# EAGLE design AKA-BeagleBone-ProtoBoard-v0.1 (EAGLE 6.5.0)
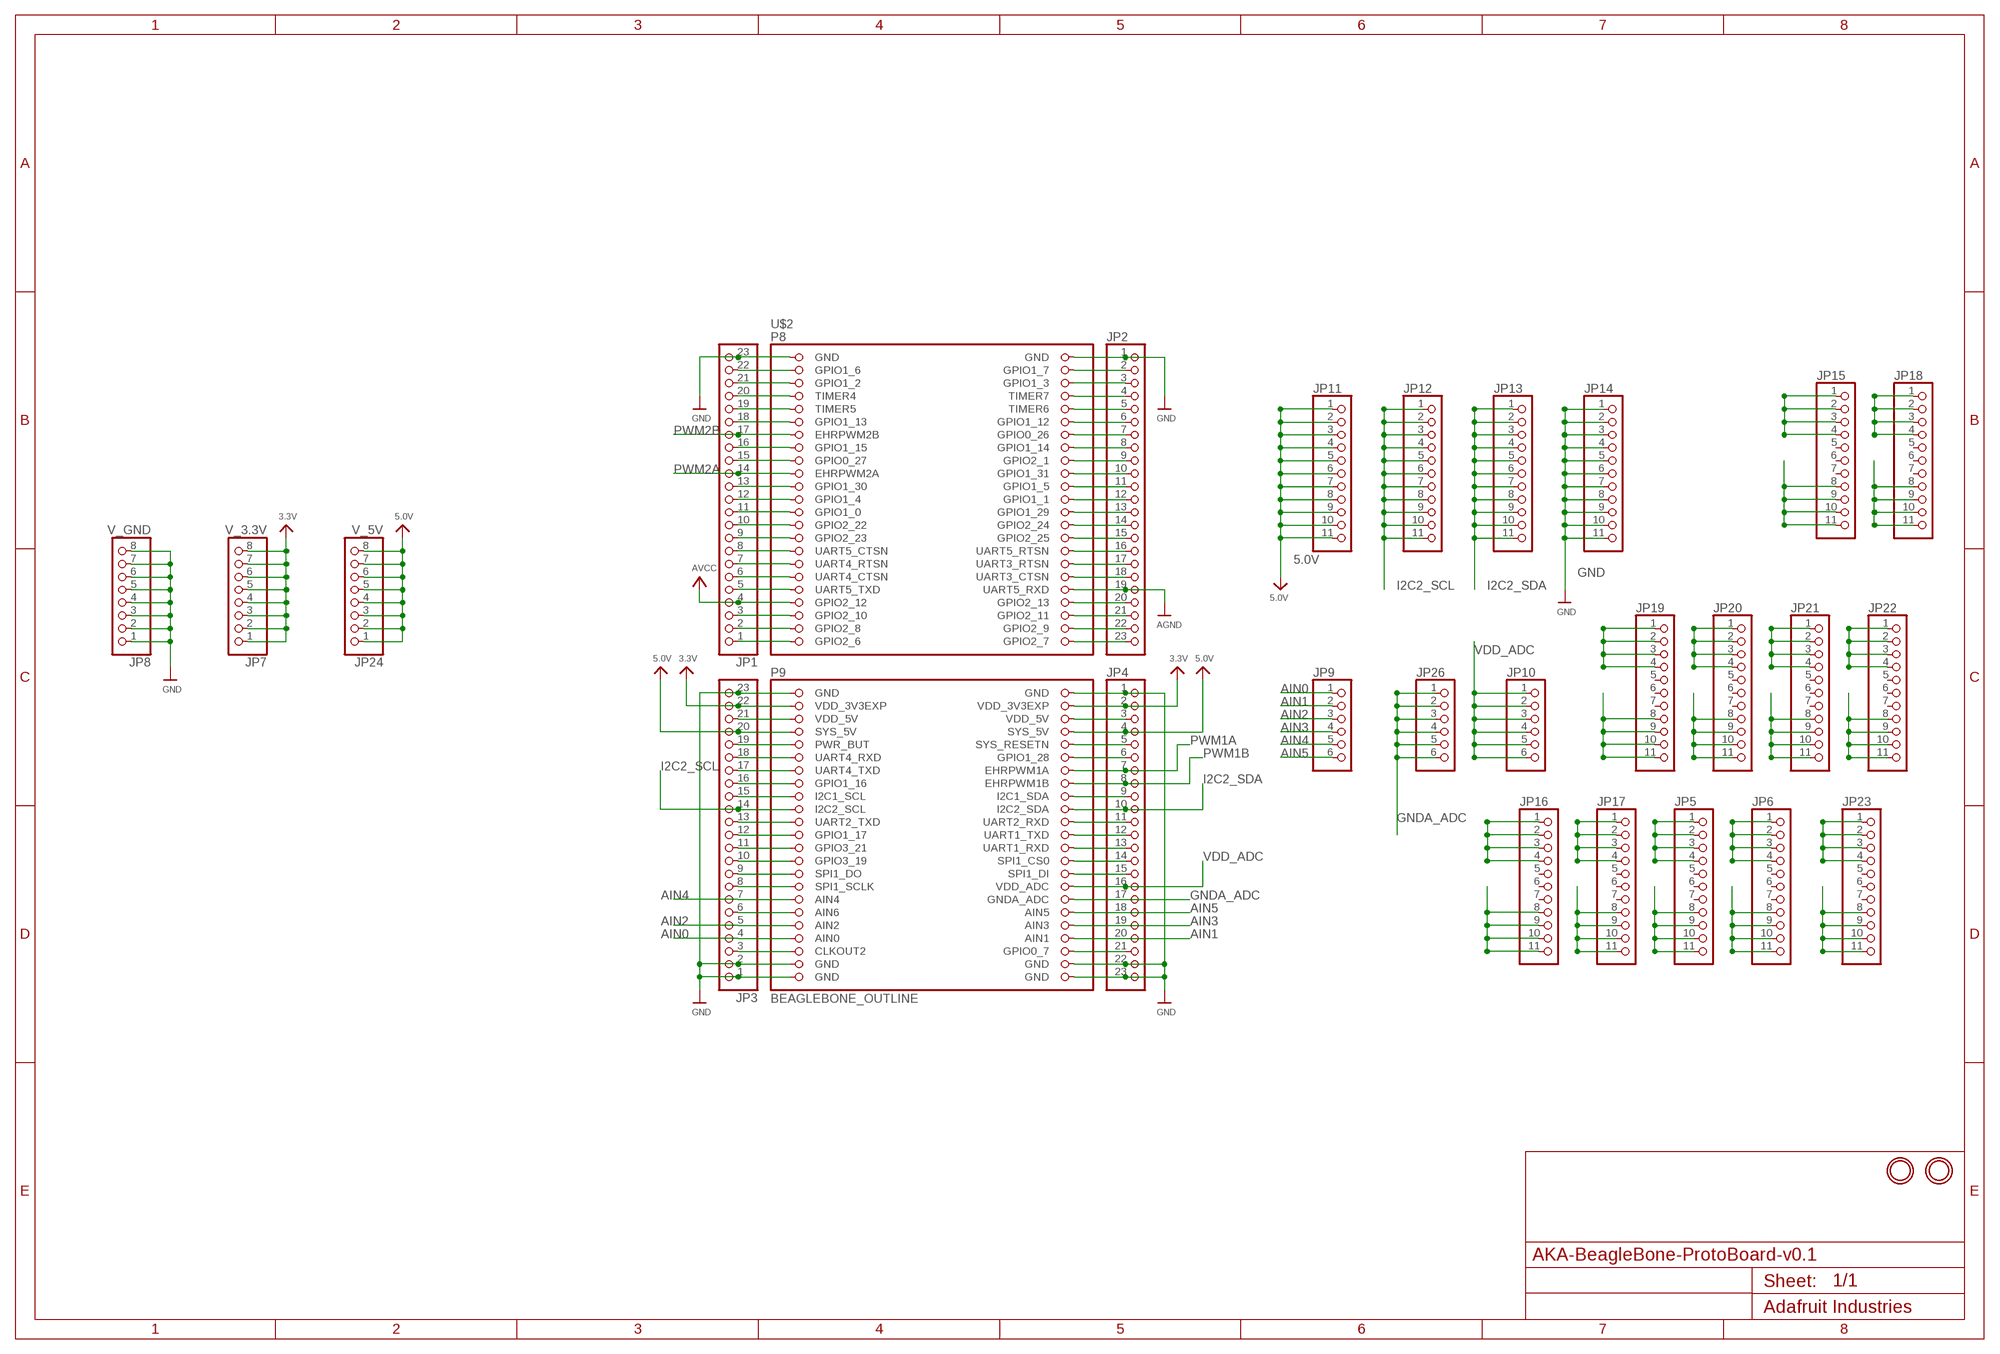
[diagram p0: schematic, sheet 1]

## Parts
JP1  HEADER-1X23  [1X23_ROUND_70MIL]
JP2  HEADER-1X23  [1X23_ROUND_70MIL]
JP3  HEADER-1X23  [1X23_ROUND_70MIL]
JP4  HEADER-1X23  [1X23_ROUND_70MIL]
JP5  HEADER-1X1176MIL  [1X11_ROUND_76]
JP6  HEADER-1X1176MIL  [1X11_ROUND_76]
JP7  V_3.3V  HEADER-1X870MIL  [1X08_ROUND_70]
JP8  V_GND  HEADER-1X870MIL  [1X08_ROUND_70]
JP9  HEADER-1X676MIL  [1X06_ROUND_76]
JP10  HEADER-1X676MIL  [1X06_ROUND_76]
JP11  HEADER-1X1176MIL  [1X11_ROUND_76]
JP12  HEADER-1X1176MIL  [1X11_ROUND_76]
JP13  HEADER-1X1176MIL  [1X11_ROUND_76]
JP14  HEADER-1X1176MIL  [1X11_ROUND_76]
JP15  HEADER-1X1176MIL  [1X11_ROUND_76]
JP16  HEADER-1X1176MIL  [1X11_ROUND_76]
JP17  HEADER-1X1176MIL  [1X11_ROUND_76]
JP18  HEADER-1X1176MIL  [1X11_ROUND_76]
JP19  HEADER-1X1176MIL  [1X11_ROUND_76]
JP20  HEADER-1X1176MIL  [1X11_ROUND_76]
JP21  HEADER-1X1176MIL  [1X11_ROUND_76]
JP22  HEADER-1X1176MIL  [1X11_ROUND_76]
JP23  HEADER-1X1176MIL  [1X11_ROUND_76]
JP24  V_5V  HEADER-1X870MIL  [1X08_ROUND_70]
JP26  HEADER-1X676MIL  [1X06_ROUND_76]
U$2  BEAGLEBONE_OUTLINE  [BEAGLEBONE_SHIELD]
U$22  MOUNTINGHOLE3.0THIN  [MOUNTINGHOLE_3.0_PLATEDTHIN]
U$23  MOUNTINGHOLE3.0THIN  [MOUNTINGHOLE_3.0_PLATEDTHIN]

## Nets
3.3V: JP3.22 JP4.2 JP7.1 JP7.2 JP7.3 JP7.4 JP7.5 JP7.6 JP7.7 JP7.8 U$2.49(VDD_3V3EXP) U$2.50(VDD_3V3EXP)
5.0V: JP3.20 JP4.4 JP11.1 JP11.2 JP11.3 JP11.4 JP11.5 JP11.6 JP11.7 JP11.8 JP11.9 JP11.10 JP11.11 JP24.1 JP24.2 JP24.3 JP24.4 JP24.5 JP24.6 JP24.7 JP24.8 U$2.53(SYS_5V) U$2.54(SYS_5V)
AGND: JP2.19 U$2.38(UART5_RXD)
AIN0: JP3.4 JP9.1 U$2.85(AIN0)
AIN1: JP4.20 JP9.2 U$2.86(AIN1)
AIN2: JP3.5 JP9.3 U$2.83(AIN2)
AIN3: JP4.19 JP9.4 U$2.84(AIN3)
AIN4: JP3.7 JP9.5 U$2.79(AIN4)
AIN5: JP4.18 JP9.6 U$2.82(AIN5)
AIN6: JP3.6 U$2.81(AIN6)
AVCC: JP1.4 U$2.39(GPIO2_12)
GND: JP1.23 JP2.1 JP3.1 JP3.2 JP3.23 JP4.1 JP4.22 JP4.23 JP8.1 JP8.2 JP8.3 JP8.4 JP8.5 JP8.6 JP8.7 JP8.8 JP14.1 JP14.2 JP14.3 JP14.4 JP14.5 JP14.6 JP14.7 JP14.8 JP14.9 JP14.10 JP14.11 U$2.1(GND) U$2.2(GND) U$2.47(GND) U$2.48(GND) U$2.89(GND) U$2.90(GND) U$2.91(GND) U$2.92(GND)
GNDA_ADC: JP4.17 JP26.1 JP26.2 JP26.3 JP26.4 JP26.5 JP26.6 U$2.80(GNDA_ADC)
I2C2_SCL: JP3.14 JP12.1 JP12.2 JP12.3 JP12.4 JP12.5 JP12.6 JP12.7 JP12.8 JP12.9 JP12.10 JP12.11 U$2.65(I2C2_SCL)
I2C2_SDA: JP4.10 JP13.1 JP13.2 JP13.3 JP13.4 JP13.5 JP13.6 JP13.7 JP13.8 JP13.9 JP13.10 JP13.11 U$2.66(I2C2_SDA)
N$1: JP15.1 JP15.2 JP15.3 JP15.4
N$2: JP16.1 JP16.2 JP16.3 JP16.4
N$3: JP17.1 JP17.2 JP17.3 JP17.4
N$4: JP1.20 U$2.7(TIMER4)
N$5: JP1.19 U$2.9(TIMER5)
N$6: JP1.18 U$2.11(GPIO1_13)
N$7: JP5.1 JP5.2 JP5.3 JP5.4
N$8: JP1.16 U$2.15(GPIO1_15)
N$9: JP1.15 U$2.17(GPIO0_27)
N$10: JP18.1 JP18.2 JP18.3 JP18.4
N$11: JP1.13 U$2.21(GPIO1_30)
N$12: JP1.12 U$2.23(GPIO1_4)
N$13: JP1.11 U$2.25(GPIO1_0)
N$14: JP1.10 U$2.27(GPIO2_22)
N$15: JP1.9 U$2.29(GPIO2_23)
N$16: JP1.8 U$2.31(UART5_CTSN)
N$17: JP1.7 U$2.33(UART4_RTSN)
N$18: JP1.6 U$2.35(UART4_CTSN)
N$19: JP1.5 U$2.37(UART5_TXD)
N$20: JP6.1 JP6.2 JP6.3 JP6.4
N$21: JP1.3 U$2.41(GPIO2_10)
N$22: JP1.2 U$2.43(GPIO2_8)
N$23: JP1.1 U$2.45(GPIO2_6)
N$24: JP19.1 JP19.2 JP19.3 JP19.4
N$25: JP20.1 JP20.2 JP20.3 JP20.4
N$26: JP21.1 JP21.2 JP21.3 JP21.4
N$27: JP2.4 U$2.8(TIMER7)
N$28: JP2.5 U$2.10(TIMER6)
N$29: JP2.6 U$2.12(GPIO1_12)
N$30: JP2.7 U$2.14(GPIO0_26)
N$31: JP2.8 U$2.16(GPIO1_14)
N$32: JP2.9 U$2.18(GPIO2_1)
N$33: JP2.10 U$2.20(GPIO1_31)
N$34: JP2.11 U$2.22(GPIO1_5)
N$35: JP2.12 U$2.24(GPIO1_1)
N$36: JP2.13 U$2.26(GPIO1_29)
N$37: JP2.14 U$2.28(GPIO2_24)
N$38: JP2.15 U$2.30(GPIO2_25)
N$39: JP2.16 U$2.32(UART5_RTSN)
N$40: JP2.17 U$2.34(UART3_RTSN)
N$41: JP2.18 U$2.36(UART3_CTSN)
N$42: JP22.1 JP22.2 JP22.3 JP22.4
N$43: JP2.20 U$2.40(GPIO2_13)
N$44: JP2.21 U$2.42(GPIO2_11)
N$45: JP2.22 U$2.44(GPIO2_9)
N$46: JP2.23 U$2.46(GPIO2_7)
N$47: JP1.22 U$2.3(GPIO1_6)
N$48: JP1.21 U$2.5(GPIO1_2)
N$49: JP3.21 U$2.51(VDD_5V)
N$50: JP2.2 U$2.4(GPIO1_7)
N$51: JP3.19 U$2.55(PWR_BUT)
N$52: JP3.18 U$2.57(UART4_RXD)
N$53: JP3.17 U$2.59(UART4_TXD)
N$54: JP3.16 U$2.61(GPIO1_16)
N$55: JP3.15 U$2.63(I2C1_SCL)
N$56: JP23.1 JP23.2 JP23.3 JP23.4
N$57: JP3.13 U$2.67(UART2_TXD)
N$58: JP3.12 U$2.69(GPIO1_17)
N$59: JP3.11 U$2.71(GPIO3_21)
N$60: JP3.10 U$2.73(GPIO3_19)
N$61: JP3.9 U$2.75(SPI1_DO)
N$62: JP3.8 U$2.77(SPI1_SCLK)
N$67: JP3.3 U$2.87(CLKOUT2)
N$68: JP2.3 U$2.6(GPIO1_3)
N$69: JP4.21 U$2.88(GPIO0_7)
N$72: JP4.3 U$2.52(VDD_5V)
N$74: JP4.5 U$2.56(SYS_RESETN)
N$75: JP4.6 U$2.58(GPIO1_28)
N$78: JP4.9 U$2.64(I2C1_SDA)
N$80: JP4.11 U$2.68(UART2_RXD)
N$81: JP4.12 U$2.70(UART1_TXD)
N$82: JP4.13 U$2.72(UART1_RXD)
N$83: JP4.14 U$2.74(SPI1_CS0)
N$84: JP4.15 U$2.76(SPI1_DI)
PWM1A: JP4.7 U$2.60(EHRPWM1A)
PWM1B: JP4.8 U$2.62(EHRPWM1B)
PWM2A: JP1.14 JP18.8 JP18.9 JP18.10 JP18.11 U$2.19(EHRPWM2A)
PWM2A1: JP17.8 JP17.9 JP17.10 JP17.11
PWM2A2: JP5.8 JP5.9 JP5.10 JP5.11
PWM2A3: JP6.8 JP6.9 JP6.10 JP6.11
PWM2A4: JP20.8 JP20.9 JP20.10 JP20.11
PWM2A5: JP21.8 JP21.9 JP21.10 JP21.11
PWM2A6: JP22.8 JP22.9 JP22.10 JP22.11
PWM2A7: JP23.8 JP23.9 JP23.10 JP23.11
PWM2B: JP1.17 JP15.8 JP15.9 JP15.10 JP15.11 U$2.13(EHRPWM2B)
PWM2B1: JP16.8 JP16.9 JP16.10 JP16.11
PWM2B2: JP19.8 JP19.9 JP19.10 JP19.11
VDD_ADC: JP4.16 JP10.1 JP10.2 JP10.3 JP10.4 JP10.5 JP10.6 U$2.78(VDD_ADC)
Unconnected: JP5.5 JP5.6 JP5.7 JP6.5 JP6.6 JP6.7 JP15.5 JP15.6 JP15.7 JP16.5 JP16.6 JP16.7 JP17.5 JP17.6 JP17.7 JP18.5 JP18.6 JP18.7 JP19.5 JP19.6 JP19.7 JP20.5 JP20.6 JP20.7 JP21.5 JP21.6 JP21.7 JP22.5 JP22.6 JP22.7 JP23.5 JP23.6 JP23.7

## Library data of the parts
JP1-JP4 = microbuilder:HEADER-1X23
JP5 JP6 JP11-JP23 = microbuilder:HEADER-1X11
JP7 JP8 JP24 = microbuilder:HEADER-1X8: PIN HEADER
JP9 JP10 JP26 = microbuilder:HEADER-1X6: PIN HEADER
U$2 = microbuilder:BEAGLEBONE_OUTLINE
U$22 U$23 = microbuilder:MOUNTINGHOLE: Mounting Hole

## Board
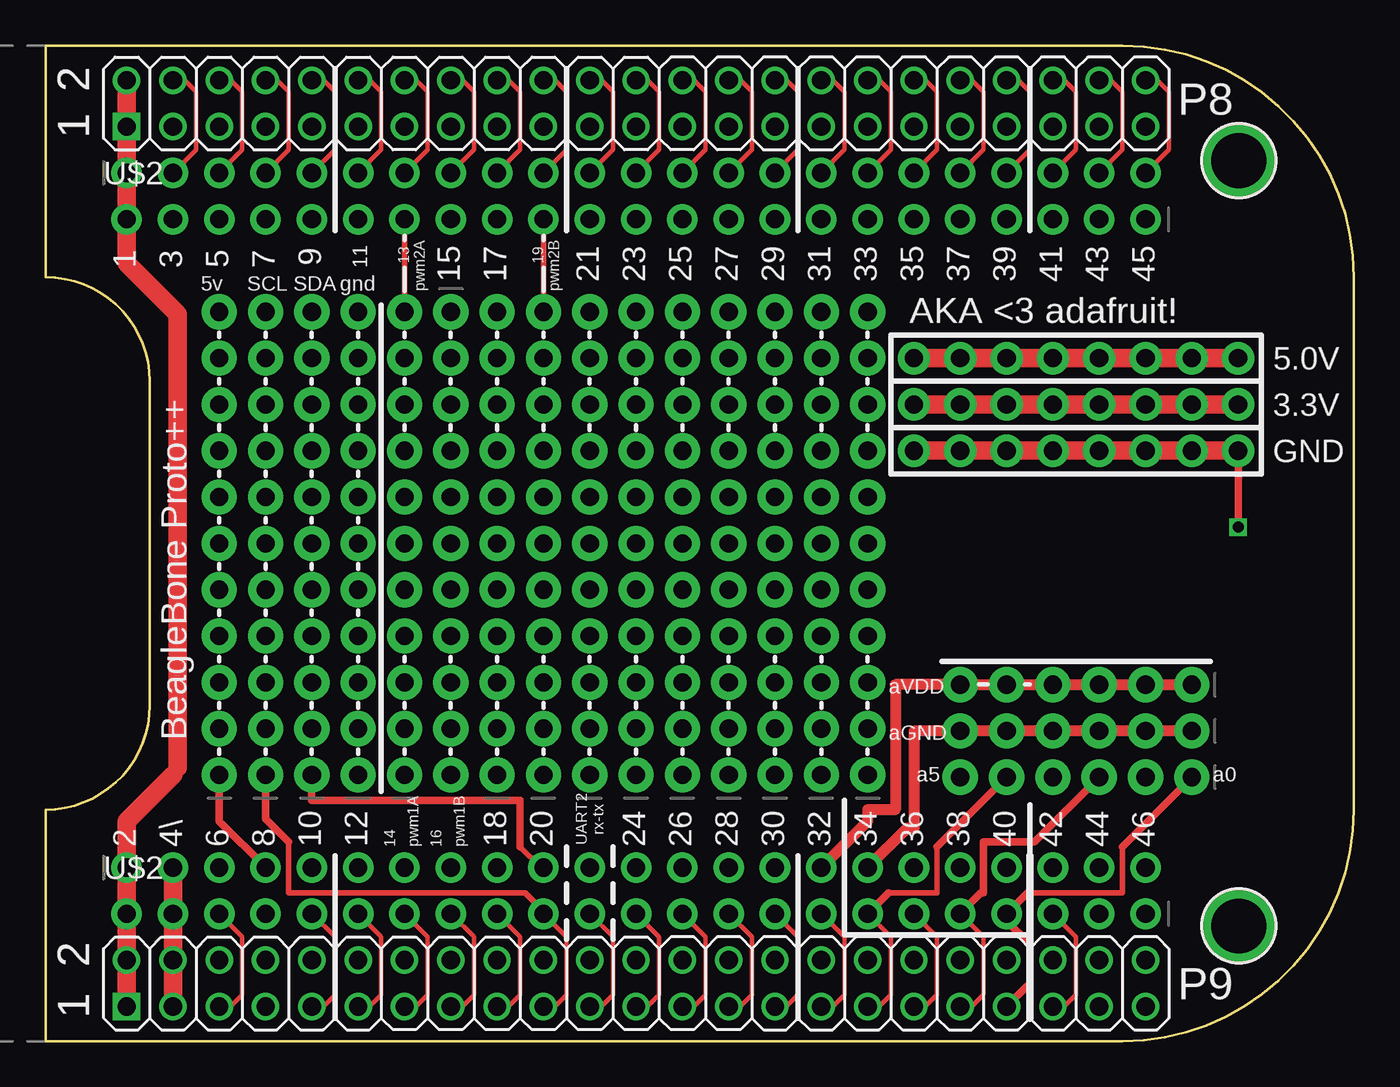
[diagram p1: board, top side]
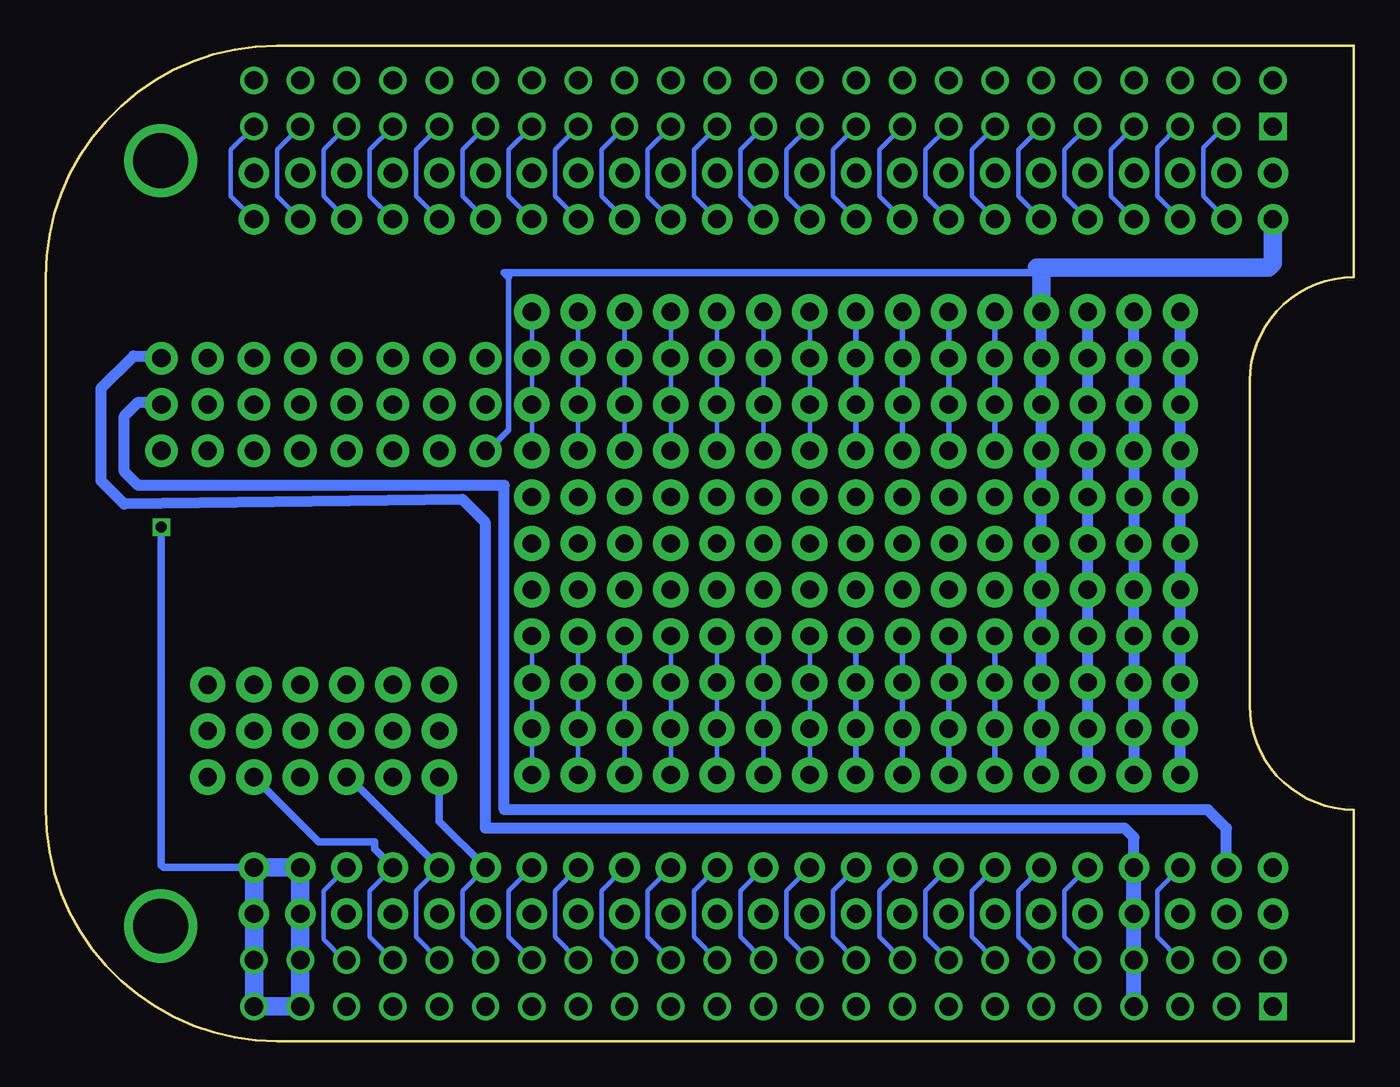
[diagram p2: board, bottom side, seen from below]

Size 71.75 x 54.61 mm. Coordinates in mm from the lower left corner, seen from the top.
Copper layers (1*16): Top 0.0356mm / dielectric 1.5011mm / Bottom 0.0356mm
Design rules "LaenPCBOrder": minimum track width 6mil, minimum drill 13mil, track to track 6mil, track to pad 6mil, pad to pad 6mil, via to via 6mil, smd to smd 6mil, copper to edge 15mil, drill to drill 6mil, minimum pad ring 7mil, minimum via ring 7mil, stop-mask expansion 3mil, vias tented up to drill 0mil, thermal gap 10mil

### Footprints (pad centres in the part's own frame; a part is rotated, then mirrored left to right if it is on the bottom)
1X23_ROUND_70MIL = drill 1 pad 1.676: 1 -27.94,0; 2 -25.4,0; 3 -22.86,0; 4 -20.32,0; 5 -17.78,0; 6 -15.24,0; 7 -12.7,0; 8 -10.16,0; 9 -7.62,0; 10 -5.08,0; 11 -2.54,0; 12 0,0; 13 2.54,0; 14 5.08,0; 15 7.62,0; 16 10.16,0; 17 12.7,0; 18 15.24,0; 19 17.78,0; 20 20.32,0; 21 22.86,0; 22 25.4,0; 23 27.94,0
1X11_ROUND_76 = drill 1 pad 1.93: 1 -12.7,0; 2 -10.16,0; 3 -7.62,0; 4 -5.08,0; 5 -2.54,0; 6 0,0; 7 2.54,0; 8 5.08,0; 9 7.62,0; 10 10.16,0; 11 12.7,0
1X08_ROUND_70 = drill 1 pad 1.778: 1 -8.89,0; 2 -6.35,0; 3 -3.81,0; 4 -1.27,0; 5 1.27,0; 6 3.81,0; 7 6.35,0; 8 8.89,0
1X06_ROUND_76 = drill 1 pad 1.93: 1 -6.35,0; 2 -3.81,0; 3 -1.27,0; 4 1.27,0; 5 3.81,0; 6 6.35,0
BEAGLEBONE_SHIELD = drill 1 square: 1 4.445,19.05; 47 52.705,19.05 | drill 1: 2 1.905,19.05; 3 4.445,21.59; 4 1.905,21.59; 5 4.445,24.13; 6 1.905,24.13; 7 4.445,26.67; 8 1.905,26.67; 9 4.445,29.21; 10 1.905,29.21; 11 4.445,31.75; 12 1.905,31.75; 13 4.445,34.29; 14 1.905,34.29; 15 4.445,36.83; 16 1.905,36.83; 17 4.445,39.37; 18 1.905,39.37; 19 4.445,41.91; 20 1.905,41.91; 21 4.445,44.45; 22 1.905,44.45; 23 4.445,46.99; 24 1.905,46.99; 25 4.445,49.53; 26 1.905,49.53; 27 4.445,52.07; 28 1.905,52.07; 29 4.445,54.61; 30 1.905,54.61; 31 4.445,57.15; 32 1.905,57.15; 33 4.445,59.69; 34 1.905,59.69; 35 4.445,62.23; 36 1.905,62.23; 37 4.445,64.77; 38 1.905,64.77; 39 4.445,67.31; 40 1.905,67.31; 41 4.445,69.85; 42 1.905,69.85; 43 4.445,72.39; 44 1.905,72.39; 45 4.445,74.93; 46 1.905,74.93; 48 50.165,19.05; 49 52.705,21.59; 50 50.165,21.59; 51 52.705,24.13; 52 50.165,24.13; 53 52.705,26.67; 54 50.165,26.67; 55 52.705,29.21; 56 50.165,29.21; 57 52.705,31.75; 58 50.165,31.75; 59 52.705,34.29; 60 50.165,34.29; 61 52.705,36.83; 62 50.165,36.83; 63 52.705,39.37; 64 50.165,39.37; 65 52.705,41.91; 66 50.165,41.91; 67 52.705,44.45; 68 50.165,44.45; 69 52.705,46.99; 70 50.165,46.99; 71 52.705,49.53; 72 50.165,49.53; 73 52.705,52.07; 74 50.165,52.07; 75 52.705,54.61; 76 50.165,54.61; 77 52.705,57.15; 78 50.165,57.15; 79 52.705,59.69; 80 50.165,59.69; 81 52.705,62.23; 82 50.165,62.23; 83 52.705,64.77; 84 50.165,64.77; 85 52.705,67.31; 86 50.165,67.31; 87 52.705,69.85; 88 50.165,69.85; 89 52.705,72.39; 90 50.165,72.39; 91 52.705,74.93; 92 50.165,74.93
MOUNTINGHOLE_3.0_PLATEDTHIN = drill 3 pad 3.6: P$1 0,0

### Placement (x,y rotation side)
JP1  32.39,45.09 180 top
JP2  32.39,47.62 0 top
JP3  32.39,6.99 180 top
JP4  32.39,9.53 0 top
JP5  29.85,27.3 90 top
JP6  32.39,27.3 90 top
JP7  56.52,34.92 0 top
JP8  56.52,32.38 0 top
JP9  56.52,14.48 180 top
JP10  56.52,19.56 180 top
JP11  9.52,27.3 90 top
JP12  12.07,27.3 90 top
JP13  14.61,27.3 90 top
JP14  17.14,27.3 90 top
JP15  19.68,27.3 90 top
JP16  22.22,27.3 270 top
JP17  24.76,27.3 90 top
JP18  27.3,27.3 90 top
JP19  34.92,27.3 90 top
JP20  37.47,27.3 90 top
JP21  40,27.3 90 top
JP22  42.55,27.3 90 top
JP23  45.08,27.3 90 top
JP24  56.52,37.47 0 top
JP26  56.52,17.02 180 top
U$2  -14.61,54.61 270 top
U$22  65.44,48.3 0 top
U$23  65.44,6.32 0 top

### Tracks (layer width: path | path; a pad name or v marks a point on that pad's centre or on a via)
3.3V
  Top 1.016: JP7.8 JP7.7 JP7.6 JP7.5 JP7.4 JP7.3 JP7.2 JP7.1 | U$2.49 U$2.50 JP3.22 JP4.2
  Bottom 0.61: JP4.2 6.98,11.68 8,12.7 46.61,12.7 46.61,30.48 66.67,30.48 67.44,31.24 67.44,34.29 66.67,35.05 65.53,35.05 JP7.8
5.0V
  Top 0.406: JP11.1 9.52,12.06 JP4.4
  Top 1.016: JP24.1 JP24.2 JP24.3 JP24.4 JP24.5 JP24.6 JP24.7 JP24.8
  Bottom 0.61: JP4.4 12.07,11.18 12.57,11.68 47.62,11.68 47.62,28.45 48.89,29.72 67.44,29.46 68.71,30.73 68.71,35.81 66.93,37.59 65.53,37.59 JP24.8 | JP11.1 JP11.2 JP11.3 JP11.4 JP11.5 JP11.6 JP11.7 JP11.8 JP11.9 JP11.10 JP11.11
  Bottom 0.813: U$2.53 U$2.54 JP3.20 JP4.4
AGND
  Top 0.254: U$2.38 50.8,52.7 51.44,52.07 51.44,48.9 JP2.19
AIN0
  Top 0.305: 59.05,10.67 59.05,8.13 53.85,8.13
  Top 0.406: JP9.1 59.05,10.67 | 53.85,8.13 JP3.4 52.7,6.6 53.97,5.33 53.97,3.05 53.85,3.05 U$2.85
AIN1
  Bottom 0.254: JP4.20 53.97,8.26 53.97,5.71 U$2.86
  Bottom 0.406: JP9.2 56.77,10.92 53.72,10.92 53.72,10.54 JP4.20
AIN2
  Top 0.254: U$2.83 50.8,1.91 51.44,2.54 51.44,5.71 JP3.5
  Top 0.406: JP9.3 54.23,10.92 51.44,10.92 51.44,8.13 51.31,8.13 JP3.5
AIN3
  Bottom 0.254: JP4.19 51.44,8.26 51.44,5.71 U$2.84
  Bottom 0.406: JP9.4 55.12,14.48 JP4.19
AIN4
  Top 0.254: U$2.79 45.72,1.91 46.36,2.54 46.36,5.71 JP3.7
  Top 0.305: 48.89,10.67 48.89,8.13 46.23,8.13
  Top 0.406: JP9.5 48.89,10.67 | 46.23,8.13 JP3.7
AIN5
  Bottom 0.254: JP4.18 48.89,8.26 48.89,5.71 U$2.82
  Bottom 0.406: JP9.6 50.16,12.06 JP4.18
AIN6
  Top 0.254: U$2.81 48.26,1.91 48.89,2.54 48.89,5.71 JP3.6
AVCC
  Bottom 0.254: U$2.39 53.97,48.9 53.97,46.35 JP1.4
GND  (via drill 0.6)
  Top 0.406: 7.24,14.99 6.98,14.73 6.98,14.61 | JP8.8 v65.41,28.19
  Top 1.016: JP8.1 JP8.2 JP8.3 JP8.4 JP8.5 JP8.6 JP8.7 JP8.8 | U$2.47 U$2.48 JP3.23 JP4.1 4.45,12.06 6.98,14.61 | U$2.2 U$2.1 JP2.1 JP1.23 4.45,42.67 7.24,39.88 7.24,14.99
  Bottom 0.305: 47.5,32.38 46.36,33.53 46.36,41.91
  Bottom 0.406: 47.5,32.26 47.5,32.38 | 46.36,41.91 46.61,42.16 17.65,42.16 17.4,42.42 | JP14.2 JP14.3 | JP4.23 65.28,9.53 65.41,9.65 v65.41,28.19
  Bottom 0.61: JP14.1 JP14.2 | JP14.11 JP14.10 JP14.9 JP14.8 JP14.7 JP14.6 JP14.5 JP14.4 JP14.3
  Bottom 1.016: JP8.1 47.5,32.26 | JP14.11 17.14,42.16 17.4,42.42 4.7,42.42 4.45,42.67 JP1.23 | U$2.92 U$2.91 U$2.89 U$2.90 JP3.2 JP4.22 JP4.23 JP3.1 U$2.92
GNDA_ADC
  Top 0.61: JP26.1 JP26.2 JP26.3 JP26.4 JP26.5 JP26.6 47.62,17.02 47.62,11.68 47.24,11.68 JP4.17
  Bottom 0.254: JP4.17 46.36,8.26 46.36,5.71 U$2.80
I2C2_SCL
  Top 0.254: U$2.65 27.94,1.91 28.57,2.54 28.57,5.71 JP3.14
  Top 0.305: 27.3,7.11 26.29,8.13 13.34,8.13 13.34,10.92
  Top 0.406: JP3.14 27.3,7.11 | JP12.1 12.07,12.19 13.34,10.92
  Bottom 0.61: JP12.1 JP12.2 JP12.3 JP12.4 JP12.5 JP12.6 JP12.7 JP12.8 JP12.9 JP12.10 JP12.11
I2C2_SDA
  Top 0.305: 27.18,9.53 26.04,10.67
  Top 0.406: JP4.10 27.18,9.53 | 26.04,10.67 26.04,13.21 14.61,13.21 JP13.1
  Bottom 0.254: JP4.10 28.57,8.26 28.57,5.71 U$2.66
  Bottom 0.61: JP13.1 JP13.2 JP13.3 JP13.4 JP13.5 JP13.6 JP13.7 JP13.8 JP13.9 JP13.10 JP13.11
N$1
  Bottom 0.305: JP15.4 JP15.3 JP15.2 JP15.1
N$2
  Bottom 0.305: JP16.1 JP16.2 JP16.3 JP16.4
N$3
  Bottom 0.305: JP17.4 JP17.3 JP17.2 JP17.1
N$4
  Bottom 0.254: U$2.7 13.34,48.9 13.34,46.35 JP1.20
N$5
  Bottom 0.254: U$2.9 15.88,48.9 15.88,46.35 JP1.19
N$6
  Bottom 0.254: U$2.11 18.42,48.9 18.42,46.35 JP1.18
N$7
  Bottom 0.254: JP5.4 JP5.3 JP5.2 JP5.1
N$8
  Bottom 0.254: U$2.15 23.5,48.9 23.5,46.35 JP1.16
N$9
  Bottom 0.254: U$2.17 26.04,48.9 26.04,46.35 JP1.15
N$10
  Bottom 0.305: JP18.1 JP18.2 JP18.3 JP18.4
N$11
  Bottom 0.254: U$2.21 31.11,48.9 31.11,46.35 JP1.13
N$12
  Bottom 0.254: U$2.23 33.66,48.9 33.66,46.35 JP1.12
N$13
  Bottom 0.254: U$2.25 36.19,48.9 36.19,46.35 JP1.11
N$14
  Bottom 0.254: U$2.27 38.73,48.9 38.73,46.35 JP1.10
N$15
  Bottom 0.254: U$2.29 41.28,48.9 41.28,46.35 JP1.9
N$16
  Bottom 0.254: U$2.31 43.81,48.9 43.81,46.35 JP1.8
N$17
  Bottom 0.254: U$2.33 46.36,48.9 46.36,46.35 JP1.7
N$18
  Bottom 0.254: U$2.35 48.89,48.9 48.89,46.35 JP1.6
N$19
  Bottom 0.254: U$2.37 51.44,48.9 51.44,46.35 JP1.5
N$20
  Bottom 0.254: JP6.1 JP6.2 JP6.3 JP6.4
N$21
  Bottom 0.254: U$2.41 56.52,48.9 56.52,46.35 JP1.3
N$22
  Bottom 0.254: U$2.43 59.05,48.9 59.05,46.35 JP1.2
N$23
  Bottom 0.254: U$2.45 61.59,48.9 61.59,46.35 JP1.1
N$24
  Bottom 0.254: JP19.4 JP19.3 JP19.2 JP19.1
N$25
  Bottom 0.254: JP20.1 JP20.2 JP20.3 JP20.4
N$26
  Bottom 0.254: JP21.4 JP21.3 JP21.2 JP21.1
N$27
  Top 0.254: U$2.8 12.7,52.7 13.34,52.07 13.34,48.9 JP2.4
N$28
  Top 0.254: U$2.10 15.24,52.7 15.88,52.07 15.88,48.9 JP2.5
N$29
  Top 0.254: U$2.12 17.78,52.7 18.42,52.07 18.42,48.9 JP2.6
N$30
  Top 0.254: U$2.14 20.32,52.7 20.96,52.07 20.96,48.9 JP2.7
N$31
  Top 0.254: U$2.16 22.86,52.7 23.5,52.07 23.5,48.9 JP2.8
N$32
  Top 0.254: U$2.18 25.4,52.7 26.04,52.07 26.04,48.9 JP2.9
N$33
  Top 0.254: U$2.20 27.94,52.7 28.57,52.07 28.57,48.9 JP2.10
N$34
  Top 0.254: U$2.22 30.48,52.7 31.11,52.07 31.11,48.9 JP2.11
N$35
  Top 0.254: U$2.24 33.02,52.7 33.66,52.07 33.66,48.9 JP2.12
N$36
  Top 0.254: U$2.26 35.56,52.7 36.19,52.07 36.19,48.9 JP2.13
N$37
  Top 0.254: U$2.28 38.1,52.7 38.73,52.07 38.73,48.9 JP2.14
N$38
  Top 0.254: U$2.30 40.64,52.7 41.28,52.07 41.28,48.9 JP2.15
N$39
  Top 0.254: U$2.32 43.18,52.7 43.81,52.07 43.81,48.9 JP2.16
N$40
  Top 0.254: U$2.34 45.72,52.7 46.36,52.07 46.36,48.9 JP2.17
N$41
  Top 0.254: U$2.36 48.26,52.7 48.89,52.07 48.89,48.9 JP2.18
N$42
  Bottom 0.254: JP22.1 JP22.2 JP22.3 JP22.4
N$43
  Top 0.254: U$2.40 53.34,52.7 53.97,52.07 53.97,48.9 JP2.20
N$44
  Top 0.254: U$2.42 55.88,52.7 56.52,52.07 56.52,48.9 JP2.21
N$45
  Top 0.254: U$2.44 58.42,52.7 59.05,52.07 59.05,48.9 JP2.22
N$46
  Top 0.254: U$2.46 60.96,52.7 61.59,52.07 61.59,48.9 JP2.23
N$47
  Bottom 0.254: U$2.3 7.11,50.16 8.25,49.02 8.25,46.35 JP1.22
N$48
  Bottom 0.254: U$2.5 9.65,50.16 10.79,49.02 10.79,46.35 JP1.21
N$49
  Top 0.254: U$2.51 10.16,1.91 10.79,2.54 10.79,5.71 JP3.21
N$50
  Top 0.254: U$2.4 7.62,52.7 8.25,52.07 8.25,48.9 JP2.2
N$51
  Top 0.254: U$2.55 15.24,1.91 15.88,2.54 15.88,5.71 JP3.19
N$52
  Top 0.254: U$2.57 17.78,1.91 18.42,2.54 18.42,5.71 JP3.18
N$53
  Top 0.254: U$2.59 20.32,1.91 20.96,2.54 20.96,5.71 JP3.17
N$54
  Top 0.254: U$2.61 22.86,1.91 23.5,2.54 23.5,5.71 JP3.16
N$55
  Top 0.254: U$2.63 25.4,1.91 26.04,2.54 26.04,5.71 JP3.15
N$56
  Bottom 0.254: JP23.4 JP23.3 JP23.2 JP23.1
N$57
  Top 0.254: U$2.67 30.48,1.91 31.11,2.54 31.11,5.71 JP3.13
N$58
  Top 0.254: U$2.69 33.02,1.91 33.66,2.54 33.66,5.71 JP3.12
N$59
  Top 0.254: U$2.71 35.56,1.91 36.19,2.54 36.19,5.71 JP3.11
N$60
  Top 0.254: U$2.73 38.1,1.91 38.73,2.54 38.73,5.71 JP3.10
N$61
  Top 0.254: U$2.75 40.64,1.91 41.28,2.54 41.28,5.71 JP3.9
N$62
  Top 0.254: U$2.77 43.18,1.91 43.81,2.54 43.81,5.71 JP3.8
N$67
  Top 0.254: U$2.87 55.88,1.91 56.52,2.54 56.52,5.71 JP3.3
N$68
  Top 0.254: U$2.6 10.16,52.7 10.79,52.07 10.79,48.9 JP2.3
N$69
  Bottom 0.254: U$2.88 55.37,4.45 56.52,5.59 56.52,8.26 JP4.21
N$72
  Bottom 0.254: JP4.3 10.79,8.26 10.79,5.71 U$2.52
N$74
  Bottom 0.254: JP4.5 15.88,8.26 15.88,5.71 U$2.56
N$75
  Bottom 0.254: JP4.6 18.42,8.26 18.42,5.71 U$2.58
N$78
  Bottom 0.254: JP4.9 26.04,8.26 26.04,5.71 U$2.64
N$80
  Bottom 0.254: JP4.11 31.11,8.26 31.11,5.71 U$2.68
N$81
  Bottom 0.254: JP4.12 33.66,8.26 33.66,5.71 U$2.70
N$82
  Bottom 0.254: JP4.13 36.19,8.26 36.19,5.71 U$2.72
N$83
  Bottom 0.254: JP4.14 38.73,8.26 38.73,5.71 U$2.74
N$84
  Bottom 0.254: JP4.15 41.28,8.26 41.28,5.71 U$2.76
PWM1A
  Bottom 0.254: JP4.7 20.96,8.26 20.96,5.71 U$2.60
PWM1B
  Bottom 0.254: JP4.8 23.5,8.26 23.5,5.71 U$2.62
PWM2A
  Top 0.305: JP1.14 JP18.11
  Bottom 0.254: U$2.19 28.57,48.9 28.57,46.35 JP1.14
  Bottom 0.305: JP18.8 JP18.9 JP18.10 JP18.11
PWM2A1
  Bottom 0.305: JP17.11 JP17.10 JP17.9 JP17.8
PWM2A2
  Bottom 0.254: JP5.11 JP5.10 JP5.9 JP5.8
PWM2A3
  Bottom 0.254: JP6.8 JP6.9 JP6.10 JP6.11
PWM2A4
  Bottom 0.254: JP20.8 JP20.9 JP20.10 JP20.11
PWM2A5
  Bottom 0.254: JP21.11 JP21.10 JP21.9 JP21.8
PWM2A6
  Bottom 0.254: JP22.8 JP22.9 JP22.10 JP22.11
PWM2A7
  Bottom 0.254: JP23.11 JP23.10 JP23.9 JP23.8
PWM2B
  Top 0.305: JP1.17 JP15.11
  Bottom 0.254: U$2.13 20.96,48.9 20.96,46.35 JP1.17
  Bottom 0.305: JP15.8 JP15.9 JP15.10 JP15.11
PWM2B1
  Bottom 0.305: JP16.8 JP16.9 JP16.10 JP16.11
PWM2B2
  Bottom 0.254: JP19.11 JP19.10 JP19.9 JP19.8
VDD_ADC
  Top 0.61: JP4.16 45.08,12.06 45.08,12.7 46.61,12.7 46.61,19.56 JP10.6 JP10.5 JP10.4 JP10.3 JP10.2 JP10.1
  Bottom 0.254: JP4.16 43.81,8.26 43.81,5.71 U$2.78

### Text on the board
tPlace: 2 | P8 | 1 | pwm2A | pwm2B | 9 | 13 | 19 | 1 | 3 | 5 | 7 | 11 | 15 | 17 | 21 | 23 | 25 | 27 | 29 | 31 | 33 | 35 | 37 | 39 | 41 | 43 | 45 | 5v | SCL | SDA | gnd | AKA <3 adafruit! | 5.0V | 3.3V | GND | aVDD | BeagleBone Proto++ | aGND | a5 | a0 | UART2 / rx-tx | 2 | 4\ | 6 | 8 | 10 | 12 | 14 | pwm1A | 16 | pwm1B | 18 | 20 | 24 | 26 | 28 | 30 | 32 | 34 | 36 | 38 | 40 | 42 | 44 | 46 | 2 | P9 | 1